# EAGLE design RFID_dongle (EAGLE 8.7.0)
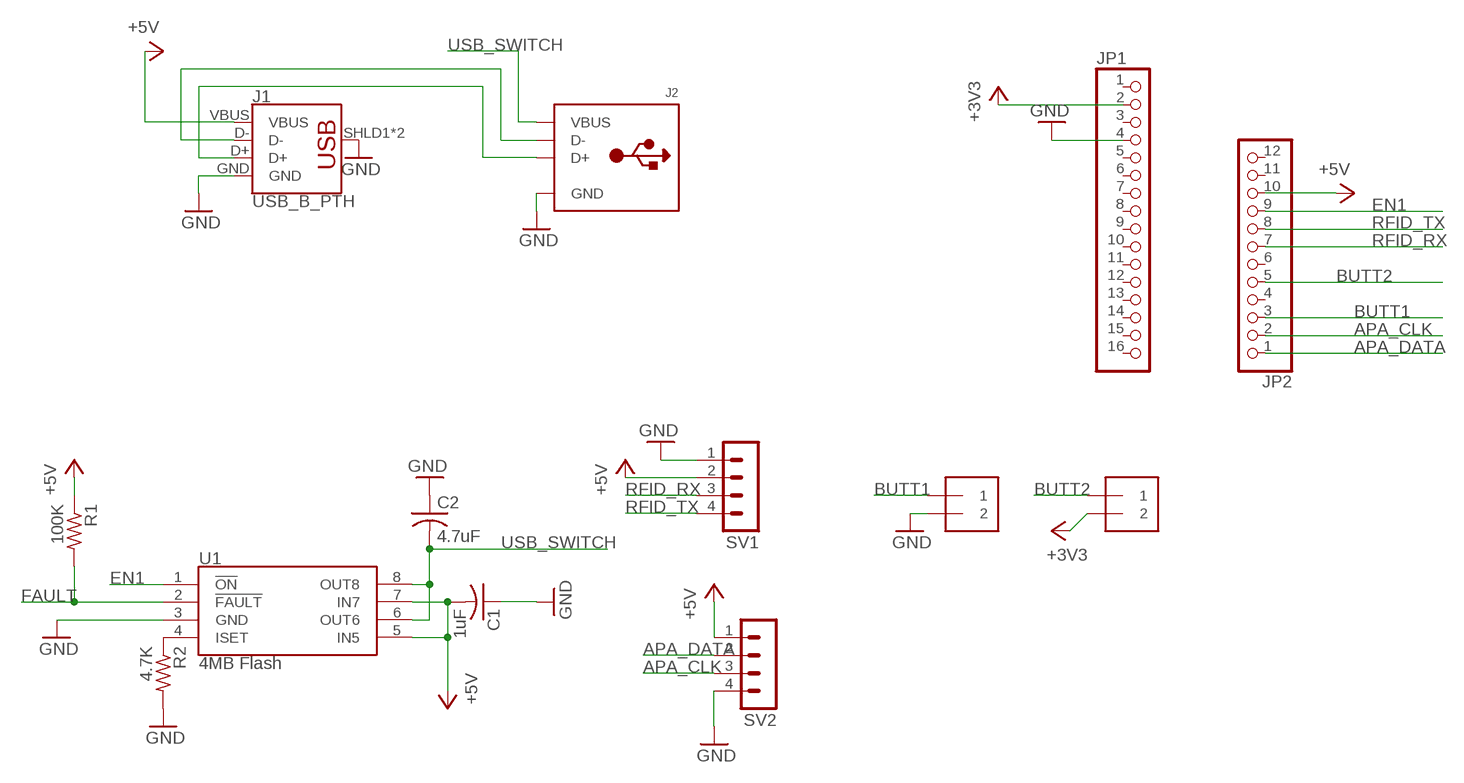
[diagram p0: schematic, sheet 1]

## Parts
C1  1uF  C-USC0805K  [C0805K]
C2  4.7uF  C-USC0805K  [C0805K]
J1  USB_B_PTH  [USB-B-PTH]
J2  USB_TYPEAPTHFML  [USB_HOST-PTH]
J5  1X2-3.5MM  [1X2-3.5MM]
J6  1X2-3.5MM  [1X2-3.5MM]
JP1  HEADER-1X16_MIN  [1X16_ROUND_MIN]
JP2  HEADER-1X12_MIN  [1X12_ROUND_MIN]
R1  100K  R-US_R0805  [R0805]
R2  4.7K  R-US_R0805  [R0805]
SV1  MA04-1  [MA04-1]
SV2  MA04-1  [MA04-1]
U1  4MB Flash  AT25SF041  [SO08]

## Nets
+3V3: J6.2 JP1.2
+5V: C1.2 J1.VBUS JP2.10 R1.1 SV1.2 SV2.1 U1.5(IN5) U1.7(IN7)
APA_CLK: JP2.2 SV2.3
APA_DATA: JP2.1 SV2.2
BUTT1: J5.1 JP2.3
BUTT2: J6.1 JP2.5
EN1: JP2.9 U1.1(!ON)
FAULT: R1.2 U1.2(!FAULT)
GND: C1.1 C2.1 J1.GND J1.SHLD1(SHIELD) J1.SHLD2(SHIELD) J2.GND J2.S1(GND) J2.S2(GND) J5.2 JP1.4 R2.2 SV1.1 SV2.4 U1.3(GND)
N$1: R2.1 U1.4(ISET)
N$2: J1.D- J2.D-
N$6: J1.D+ J2.D+
RFID_RX: JP2.7 SV1.3
RFID_TX: JP2.8 SV1.4
USB_SWITCH: C2.2 J2.VBUS U1.6(OUT6) U1.8(OUT8)
Unconnected: JP1.1 JP1.3 JP1.5 JP1.6 JP1.7 JP1.8 JP1.9 JP1.10 JP1.11 JP1.12 JP1.13 JP1.14 JP1.15 JP1.16 JP2.4 JP2.6 JP2.11 JP2.12

## Library data of the parts
C1 C2 = adafruit:C-US: CAPACITOR, American symbol
J1 = SparkFun-Connectors:USB_B: USB Type B Connector SparkFun Products: SparkFun Stepoko <https://www.sparkfun.com/products/13899> PTH; PROD_ID: CONN-08278; SF_ID: PRT-00139
J2 = microbuilder:USB_TYPEA: USB - Type A Connectors Male types stick out and are inserted into a PC or matching females parts (these are the connectors used on USB Memory Sticks, etc.). Female parts are generally used for USB Host and accept a male-type connector. SMT - 4UCON: 10017 PTHFML - Digikey: 609-1045-ND, 4UCon: 05241 PCB - Use 2.0mm thick PCBs with this footprint
J5 J6 = adafruit:1X2: 3.5mm Terminal block http://www.ladyada.net/library/pcb/eaglelibrary.html
JP1 = microbuilder:HEADER-1X16: PIN HEADER
JP2 = microbuilder:HEADER-1X12
R1 R2 = adafruit:R-US_: RESISTOR, American symbol
SV1 SV2 = con-lstb:MA04-1: PIN HEADER; OC_FARNELL: unknown; OC_NEWARK: unknown
U1 = Heep:AT25SF041: AT25SF041 4Mb Serial Flash Memory 104MHz, SPI, 8-SOIC Datasheet <http://www.adestotech.com/wp-content/uploads/DS-AT25SF041_044.pdf> SparkFun Products: SparkFun ESP8266 Thing <https://www.sparkfun.com/products/13231> SparkFun ESP8266 Thing - Dev Board <https://www.sparkfun.com/products/13711>; PROD_ID: IC-12455

## Board
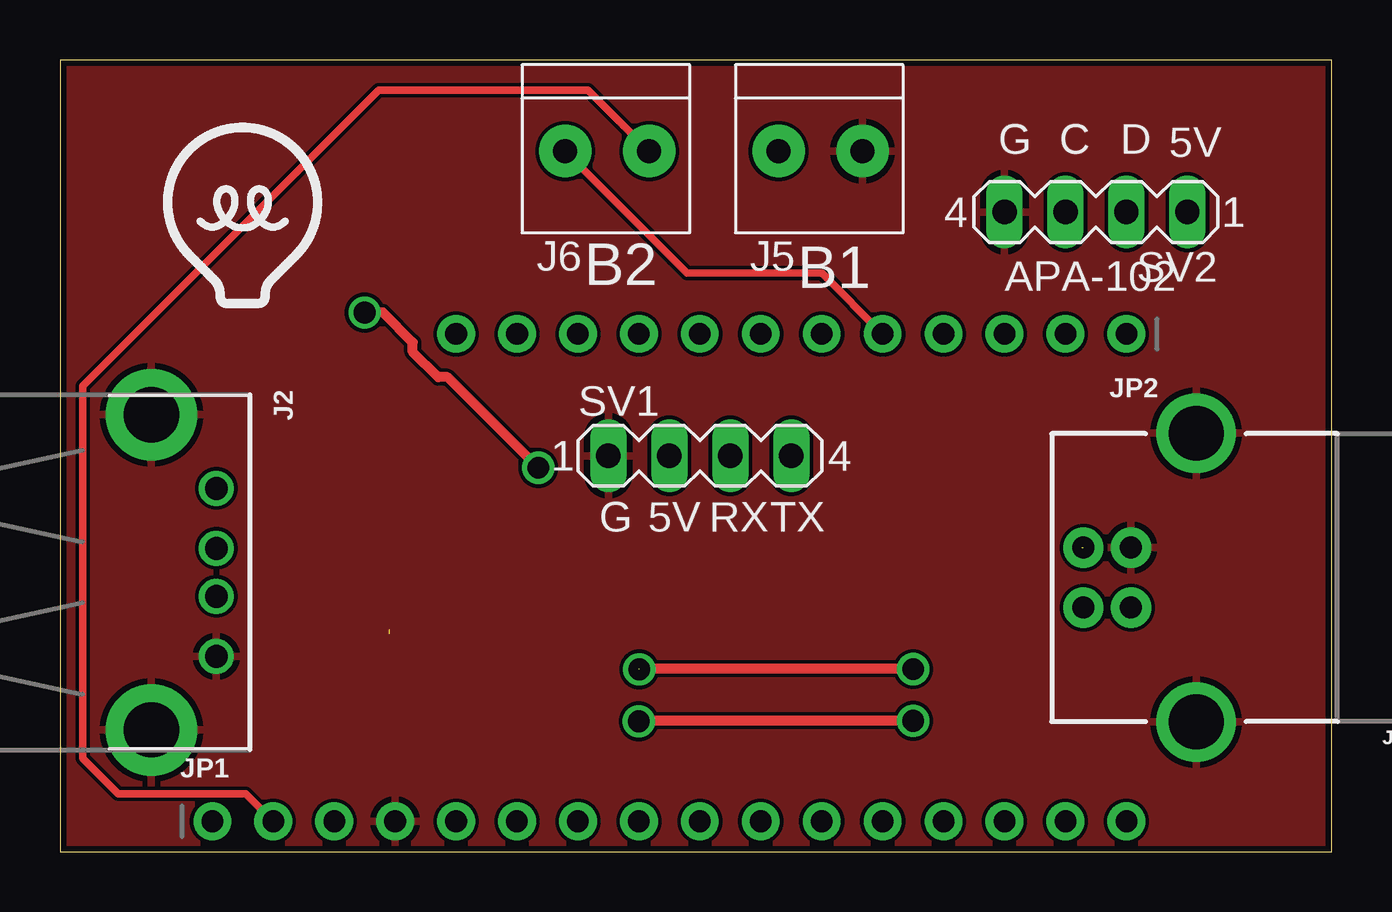
[diagram p1: board, top side]
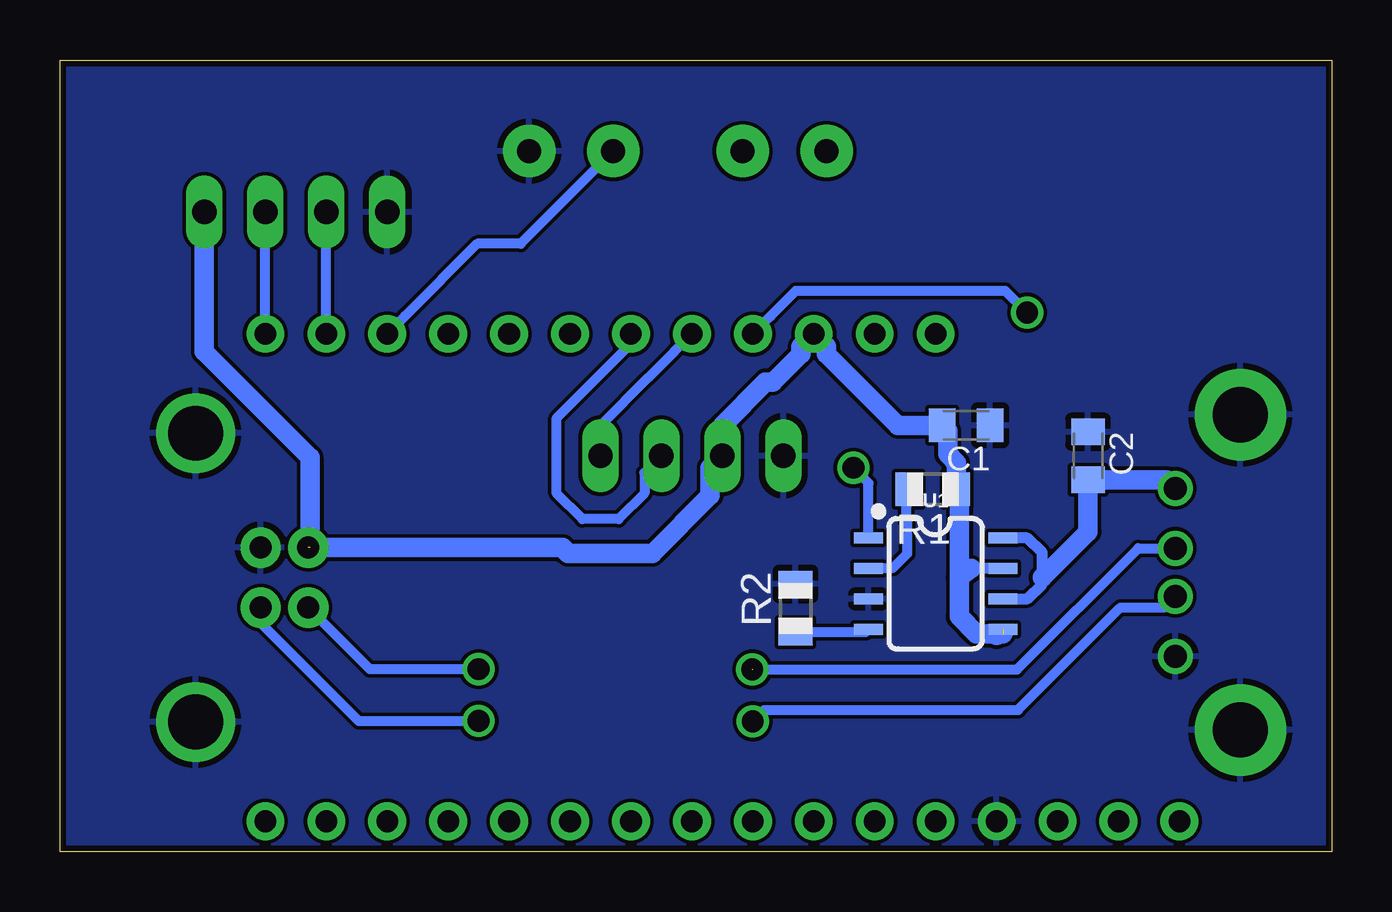
[diagram p2: board, bottom side, seen from below]

Size 53.01 x 33.01 mm. Coordinates in mm from the lower left corner, seen from the top.
Outline: 0,0 53.01,0 53.01,33.01 0,33.01 0,0
Copper layers (1*16): Top 0.035mm / dielectric 1.5mm / Bottom 0.035mm
Design rules "SeeedStudio_2layer_DRU_no_angle_20140221": minimum track width 6mil, minimum drill 12mil, track to track 6mil, track to pad 6mil, pad to pad 6mil, via to via 6mil, smd to smd 0mil, copper to edge 10mil, drill to drill 10mil, minimum pad ring 10mil, minimum via ring 6mil, stop-mask expansion 2mil, vias tented up to drill 100mil, thermal gap 10mil

### Footprints (pad centres in the part's own frame; a part is rotated, then mirrored left to right if it is on the bottom)
C0805K = smd 1.1 x 1.4: 1 -1,0; 2 1,0
USB-B-PTH = drill 0.914 pad 1.676: D+ 4,1.25; D- 5.981,1.25; GND 4,-1.25; VBUS 5.981,-1.25 | drill 2.286: SHLD1 1.282,-6.02; SHLD2 1.282,6.02
USB_HOST-PTH = drill 0.95: D+ 1,6.52; D- -1,6.52; GND 3.5,6.52; VBUS -3.5,6.52 | drill 2.3 pad 3.81: S1 -6.57,3.81; S2 6.57,3.81
1X2-3.5MM = drill 1 pad 2.184: 1 1.8,0; 2 -1.7,0
1X16_ROUND_MIN = drill 0.9 pad 1.575: 1 -19.05,0; 2 -16.51,0; 3 -13.97,0; 4 -11.43,0; 5 -8.89,0; 6 -6.35,0; 7 -3.81,0; 8 -1.27,0; 9 1.27,0; 10 3.81,0; 11 6.35,0; 12 8.89,0; 13 11.43,0; 14 13.97,0; 15 16.51,0; 16 19.05,0
1X12_ROUND_MIN = drill 0.9 pad 1.575: 1 -13.97,0; 2 -11.43,0; 3 -8.89,0; 4 -6.35,0; 5 -3.81,0; 6 -1.27,0; 7 1.27,0; 8 3.81,0; 9 6.35,0; 10 8.89,0; 11 11.43,0; 12 13.97,0
R0805 = smd 1.1 x 1.4: 1 -1,0; 2 1,0
MA04-1 = drill 1.016 long: 1 -3.81,0; 2 -1.27,0; 3 1.27,0; 4 3.81,0
SO08 = smd 0.457 x 1.2: 1 -1.905,-2.8; 2 -0.635,-2.8; 3 0.635,-2.8; 4 1.905,-2.8; 5 1.905,2.8; 6 0.635,2.8; 7 -0.635,2.8; 8 -1.905,2.8

### Placement (x,y rotation side)
C1  15.24,17.78 180 bottom
C2  10.16,16.51 270 bottom
J1  48.64,11.43 180 top
J2  0,11.65 270 top
J5  31.75,29.21 180 top
J6  22.86,29.21 180 top
JP1  25.4,1.27 0 top
JP2  30.48,21.59 180 top
R1  16.64,15.11 180 bottom
R2  22.35,10.16 90 bottom
SV1  26.67,16.51 0 top
SV2  43.18,26.67 180 top
U1  16.51,11.18 270 bottom
U$1  [HEEPLOGOSMALL]  7.62,26.67 0 top

### Tracks (layer width: path | path; a pad name or v marks a point on that pad's centre or on a via)
+3V3
  Top 0.305: J6.2 22.02,31.75 13.28,31.75 0.94,19.41 0.94,3.89 2.42,2.41 7.75,2.41 JP1.2 8.83,1.27
+5V  (2 unrouted)
  Bottom 0.406: R1.1 15.51,15.24
  Bottom 0.45: U1.7 15.02,11.81
  Bottom 0.813: SV2.1 46.99,20.85 42.58,16.45 42.58,12.68 32.06,12.68 31.83,12.45 28.32,12.45 25.91,14.86 25.91,16 SV1.2 25.4,17.78 23.6,19.58 23.3,19.58 22.12,20.76 22.12,21.06 JP2.10 21.06,21.06 21.06,20.76 18.08,17.78 C1.2 16.01,17.55 16.01,16.58 15.64,16.2 R1.1 15.53,15.01 15.53,11.43 | 15.53,11.43 15.53,9.81 14.81,9.09 14.05,9.09 13.97,9.02 13.96,9.02 13.89,9.09 13.71,9.09 | 15.02,11.81 15.53,11.43
APA_CLK
  Bottom 0.406: JP2.2 SV2.3
APA_DATA
  Bottom 0.406: JP2.1 SV2.2
BUTT1
  Bottom 0.406: J5.1 33.81,25.35 35.62,25.35 38.63,22.34 38.63,22.33 JP2.3
BUTT2
  Top 0.305: J6.1 26.14,24.13 31.75,24.13 JP2.5
EN1  (via drill 0.9)
  Top 0.406: v12.7,22.48 13.46,22.48 14.71,21.23 14.71,20.84 15.76,19.79 16.15,19.79 v19.94,16
  Bottom 0.406: U1.1 19.31,15.37 v19.94,16 | JP2.9 23.39,22.33 23.39,22.34 22.34,23.39 13.61,23.39 v12.7,22.48
FAULT
  Bottom 0.406: U1.2 19.29,11.84 18.29,11.84 17.69,12.43 17.69,13.73 17.73,13.77 17.73,15.02 R1.2
GND
  pour Bottom: -2.54,35.56 55.88,35.56 55.88,-6.35 -2.54,-6.35
  pour Top: -10.16,36.83 60.96,36.83 60.96,-3.81 -10.16,-3.81
N$1
  Bottom 0.406: R2.1 19.42,9.16 U1.4
N$2  (via drill 0.9)  (1 unrouted)
  Top 0.406: v35.56,7.62 24.17,7.62 v24.15,7.6
  Bottom 0.406: J2.D- 8.07,12.65 13.12,7.59 23.47,7.59 23.48,7.6 v24.15,7.6 | 24.1,7.59 24.13,7.62 | J1.D- 40.1,7.62 v35.56,7.62
N$6  (via drill 0.9)
  Top 0.406: v35.56,5.46 24.15,5.46 v24.13,5.44
  Bottom 0.406: J2.D+ 6.99,10.18 8.81,10.18 13.08,5.91 23.66,5.91 v24.13,5.44 | J1.D+ 44.51,10.05 44.51,9.41 40.56,5.46 v35.56,5.46
RFID_RX
  Bottom 0.406: SV1.3 28.65,15.8 28.65,14.94 29.72,13.87 31.24,13.87 32.31,14.94 32.31,18.08 29.21,21.18 JP2.7
RFID_TX
  Bottom 0.406: SV1.4 30.48,17.78 28.47,19.79 28.46,19.79 27.41,20.84 27.41,20.85 JP2.8
USB_SWITCH
  Bottom 0.45: U1.6 12.68,10.54 12.07,11.15 12.07,11.43 12.07,12.47 12.68,13.08 U1.8
  Bottom 0.813: 12.07,11.43 10.16,13.34 C2.2 6.88,15.51 J2.VBUS

### Text on the board
tPlace: G | C | D | 5V | B2 | B1 | APA-102 | G | 5V | RX | TX